# Altium project PCB_Project_4.PrjPcb
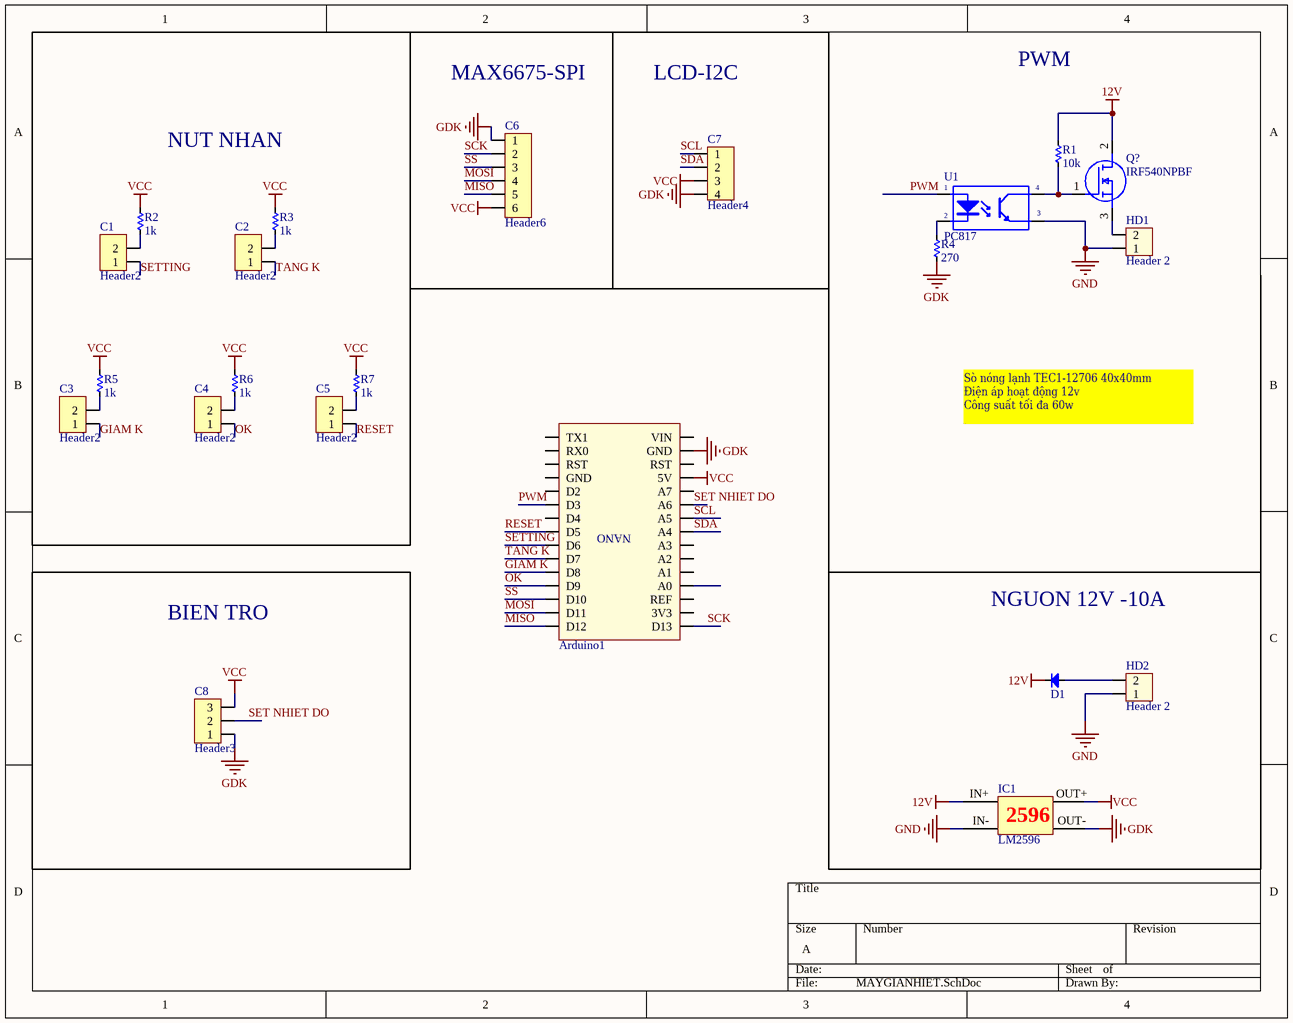
[diagram p0: MAYGIANHIET.SchDoc]
1 sheet, 22 parts. Net scope: global (net labels, ports and power ports of the same name join across sheets).
Board file: MAYGIANHIET.PcbDoc

## Sheet MAYGIANHIET.SchDoc
size A

### Parts
Arduino1  Arduino Nano  [Arduino Nano]  (value not drawn)
C1  Header2  [HDR2]
C2  Header2  [HDR2]
C3  Header2  [HDR2]
C4  Header2  [HDR2]
C5  Header2  [HDR2]
C6  Header6  [HDR6]
C7  Header4  [HDR4]
C8  Header3  [HDR3]
D1  Diode  [DIO-5A]  (value not drawn)
HD1  Header 2  [HED2T]
HD2  Header 2  [HED2T]
IC1  LM2596  [LM2596]
Q?  IRF540NPBF  [TO254P469X1042X1967-3P]
R1  10k  [RES-1/2W]
R2  1k  [RES-1/2W]
R3  1k  [RES-1/2W]
R4  270  [RES-1/2W]
R5  1k  [RES-1/2W]
R6  1k  [RES-1/2W]
R7  1k  [RES-1/2W]
U1  PC817  [DIP4]

### Blocks framed on the sheet
NUT NHAN: C1-C5 R2 R3 R5-R7
BIEN TRO: C8
NGUON 12V -10A: D1 HD2 IC1

### Nets
12V: D1.2(K) IC1.IN+ Q?.2(D) R1.2
GDK: Arduino1.GND C6.1 C7.4 C8.1 IC1.OUT- R4.2
GND: HD1.1 HD2.1 IC1.IN- U1.3(E)
VCC: Arduino1.5V C6.6 C7.3 C8.3 IC1.OUT+ R2.2 R3.2 R5.2 R6.2 R7.2
GIAM K: Arduino1.D8 C3.1
MISO: Arduino1.D12 C6.5
MOSI: Arduino1.D11 C6.4
OK: Arduino1.D9 C4.1
PWM: Arduino1.D3 U1.1(A)
RESET: Arduino1.D5 C5.1
SCK: Arduino1.D13 C6.2
SCL: Arduino1.A5 C7.1
SDA: Arduino1.A4 C7.2
SET NHIET DO: Arduino1.A6 C8.2
SETTING: Arduino1.D6 C1.1
SS: Arduino1.D10 C6.3
TANG K: Arduino1.D7 C2.1
NetC1_2: C1.2 R2.1
NetC2_2: C2.2 R3.1
NetC3_2: C3.2 R5.1
NetC4_2: C4.2 R6.1
NetC5_2: C5.2 R7.1
NetD1_1: D1.1(A) HD2.2
NetHD1_2: HD1.2 Q?.3(S)
NetQ?_1: Q?.1(G) R1.1 U1.4(C)
NetR4_1: R4.1 U1.2(K)

Not connected (* = marked no-connect by the designer): Arduino1 3V3 A0 A1 A2 A3 A7 D2 D4 REF RST RX0 TX1 VIN

### Notes on the sheet
- MAX6675-SPI
- LCD-I2C
- PWM
- Sò nóng lạnh TEC1-12706 40x40mm
  Điện áp hoạt động 12v
  Công suất tối đa 60w
- (in symbol Arduino Nano) NANO
- (in symbol LM2596) 2596

### Library data of the parts
Arduino1 = Arduino Nano: Value: Cau 1A
C1-C5 = Header2: Header IDC, 2 x 1 Pin Vertical 2.54mm Pitch (Non-Boxed, Male); Manufacturer: W¨¹rth Elektronik eiSos GmbH; partNo: 613002143121; ComponentLink1 Description: Manufacturer; ComponentLink2 Description: Datasheet; NoPins: 02; Created Date: 29 March 2013; ComponentLink1URL: http://www.we-online.com; ComponentLink2URL: http://katalog.we-online.de/em/datasheet/6130xx143121.pdf; Created by: Karrer Zheng
C6 = Header6: Header IDC, 6 x 1 Pin Vertical 2.54mm Pitch (Non-Boxed, Male); Manufacturer: W¨¹rth Elektronik eiSos GmbH; partNo: 613002143121; ComponentLink1 Description: Manufacturer; ComponentLink2 Description: Datasheet; NoPins: 02; Created Date: 29 March 2013; ComponentLink1URL: http://www.we-online.com; ComponentLink2URL: http://katalog.we-online.de/em/datasheet/6130xx143121.pdf; Created by: Karrer Zheng
C7 = Header4: Header IDC, 4 x 1 Pin Vertical 2.54mm Pitch (Non-Boxed, Male); Manufacturer: W¨¹rth Elektronik eiSos GmbH; partNo: 613002143121; ComponentLink1 Description: Manufacturer; ComponentLink2 Description: Datasheet; NoPins: 02; Created Date: 29 March 2013; ComponentLink1URL: http://www.we-online.com; ComponentLink2URL: http://katalog.we-online.de/em/datasheet/6130xx143121.pdf; Created by: Karrer Zheng
C8 = Header3: Header IDC, 3 x 1 Pin Vertical 2.54mm Pitch (Non-Boxed, Male); Manufacturer: W¨¹rth Elektronik eiSos GmbH; partNo: 613002143121; ComponentLink1 Description: Manufacturer; ComponentLink2 Description: Datasheet; NoPins: 02; Created Date: 29 March 2013; ComponentLink1URL: http://www.we-online.com; ComponentLink2URL: http://katalog.we-online.de/em/datasheet/6130xx143121.pdf; Created by: Karrer Zheng
D1 = Diode: Default Diode; Code - JEDEC: DO-214-AB; Value: 1N5007; Published: 8-Jun-2000; Revision: July-2002: Re-released for DXP Platform.; Publisher: Altium Limited
HD1 HD2 = Hed2: Header 2 (Green); Value: Header 2
Q? = IRF540NPBF: MOSFET (N-Channel); Manufacturer_Name: Infineon; Datasheet Link: https://www.infineon.com/dgdl/irf540n.pdf?fileId=5546d462533600a4015355e396cb199f; Height: 4.69mm; Manufacturer_Part_Number: IRF540NPBF; Mouser Part Number: 942-IRF540NPBF; Mouser Price/Stock: https://www.mouser.co.uk/ProductDetail/Infineon-IR/IRF540NPBF?qs=9%252BKlkBgLFf36us%252Bg5kwffA%3D%3D; Arrow Part Number: IRF540NPBF; Arrow Price/Stock: https://www.arrow.com/en/products/irf540npbf/infineon-technologies-ag?region=nac
R1-R7 = Res: Manufacturer: Generic Components; Class: Passive; SubClass: R; Published: 08/06/2000; Publisher: Altium Hobart Technology Centre
U1 = PC817: Single Opto; Value: PC817